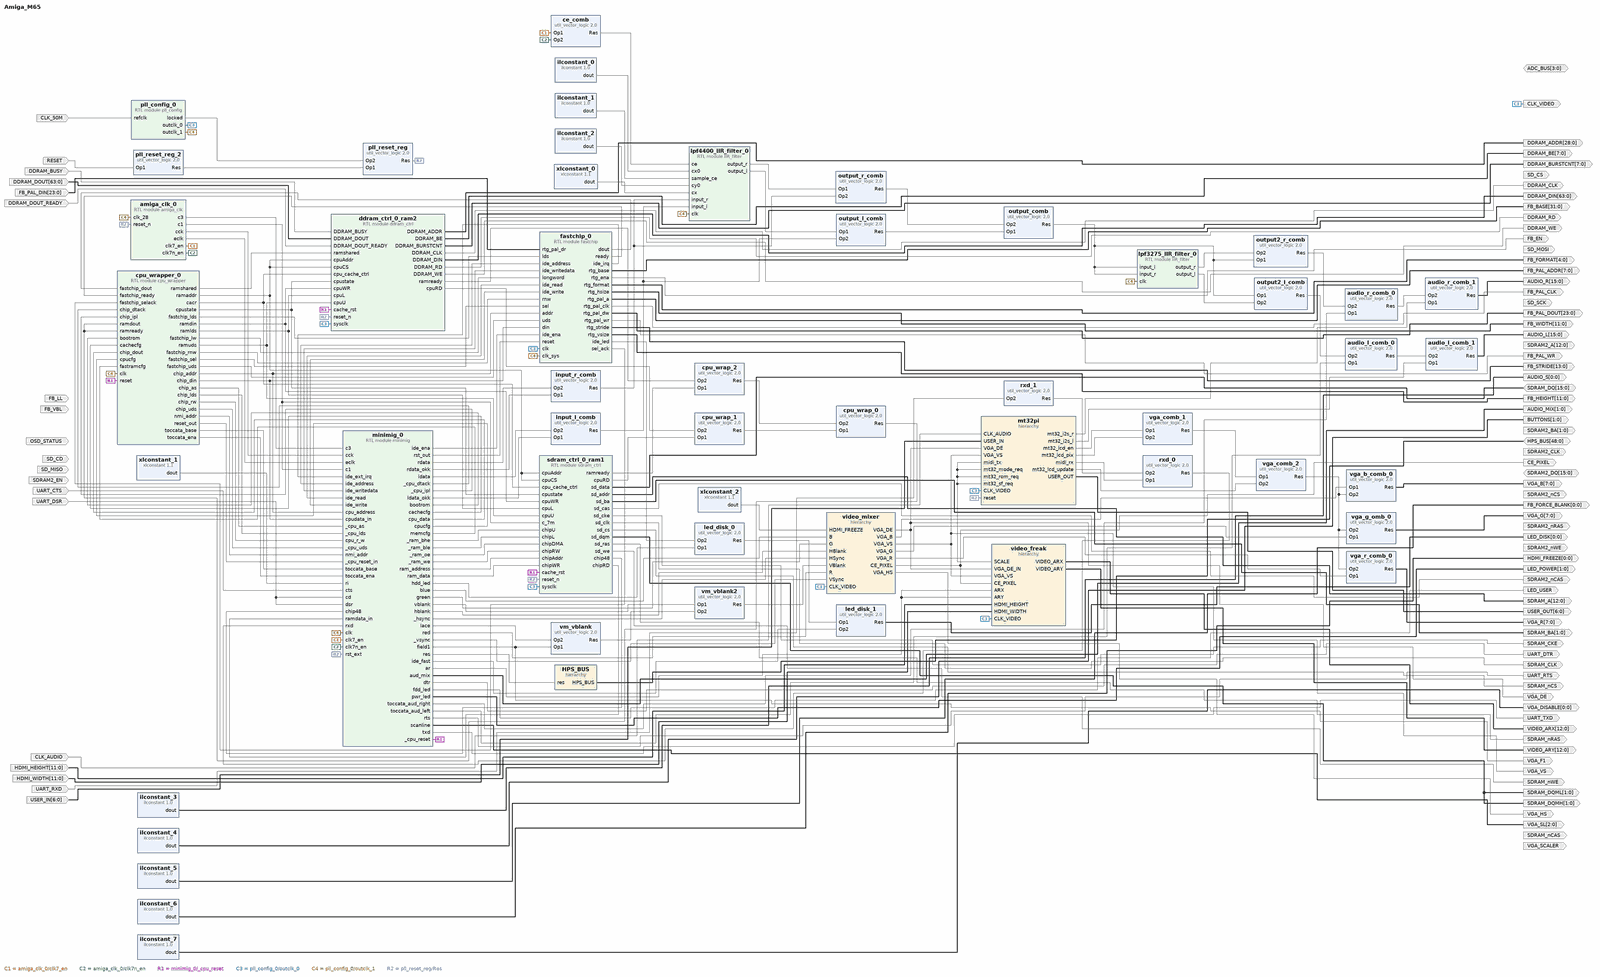
[diagram p0: block diagram of the top level, whole]
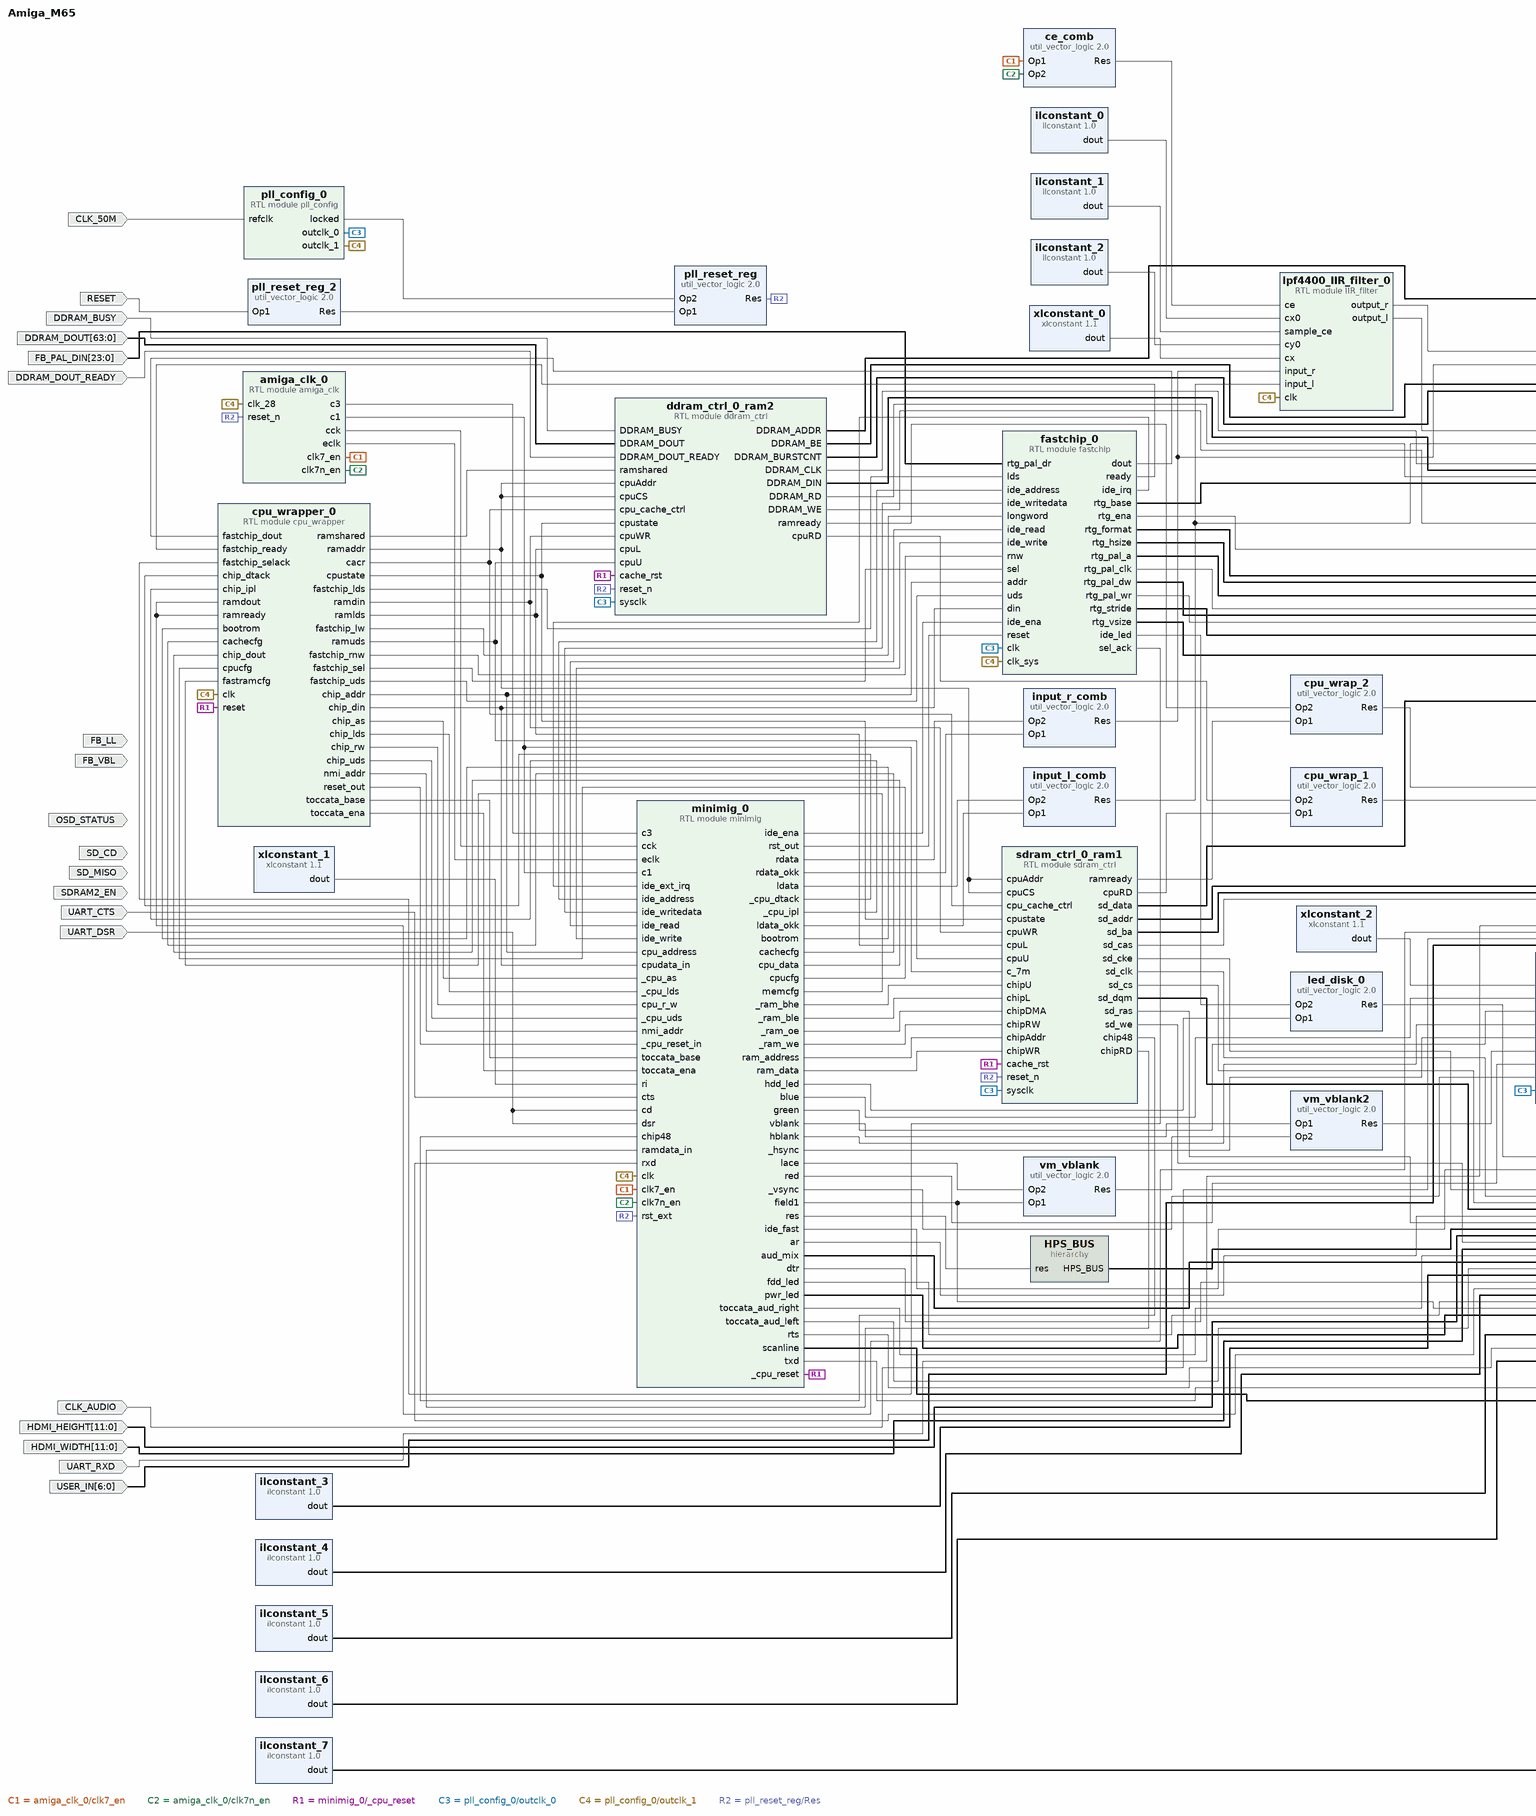
[diagram p1: block diagram of the top level, left part]
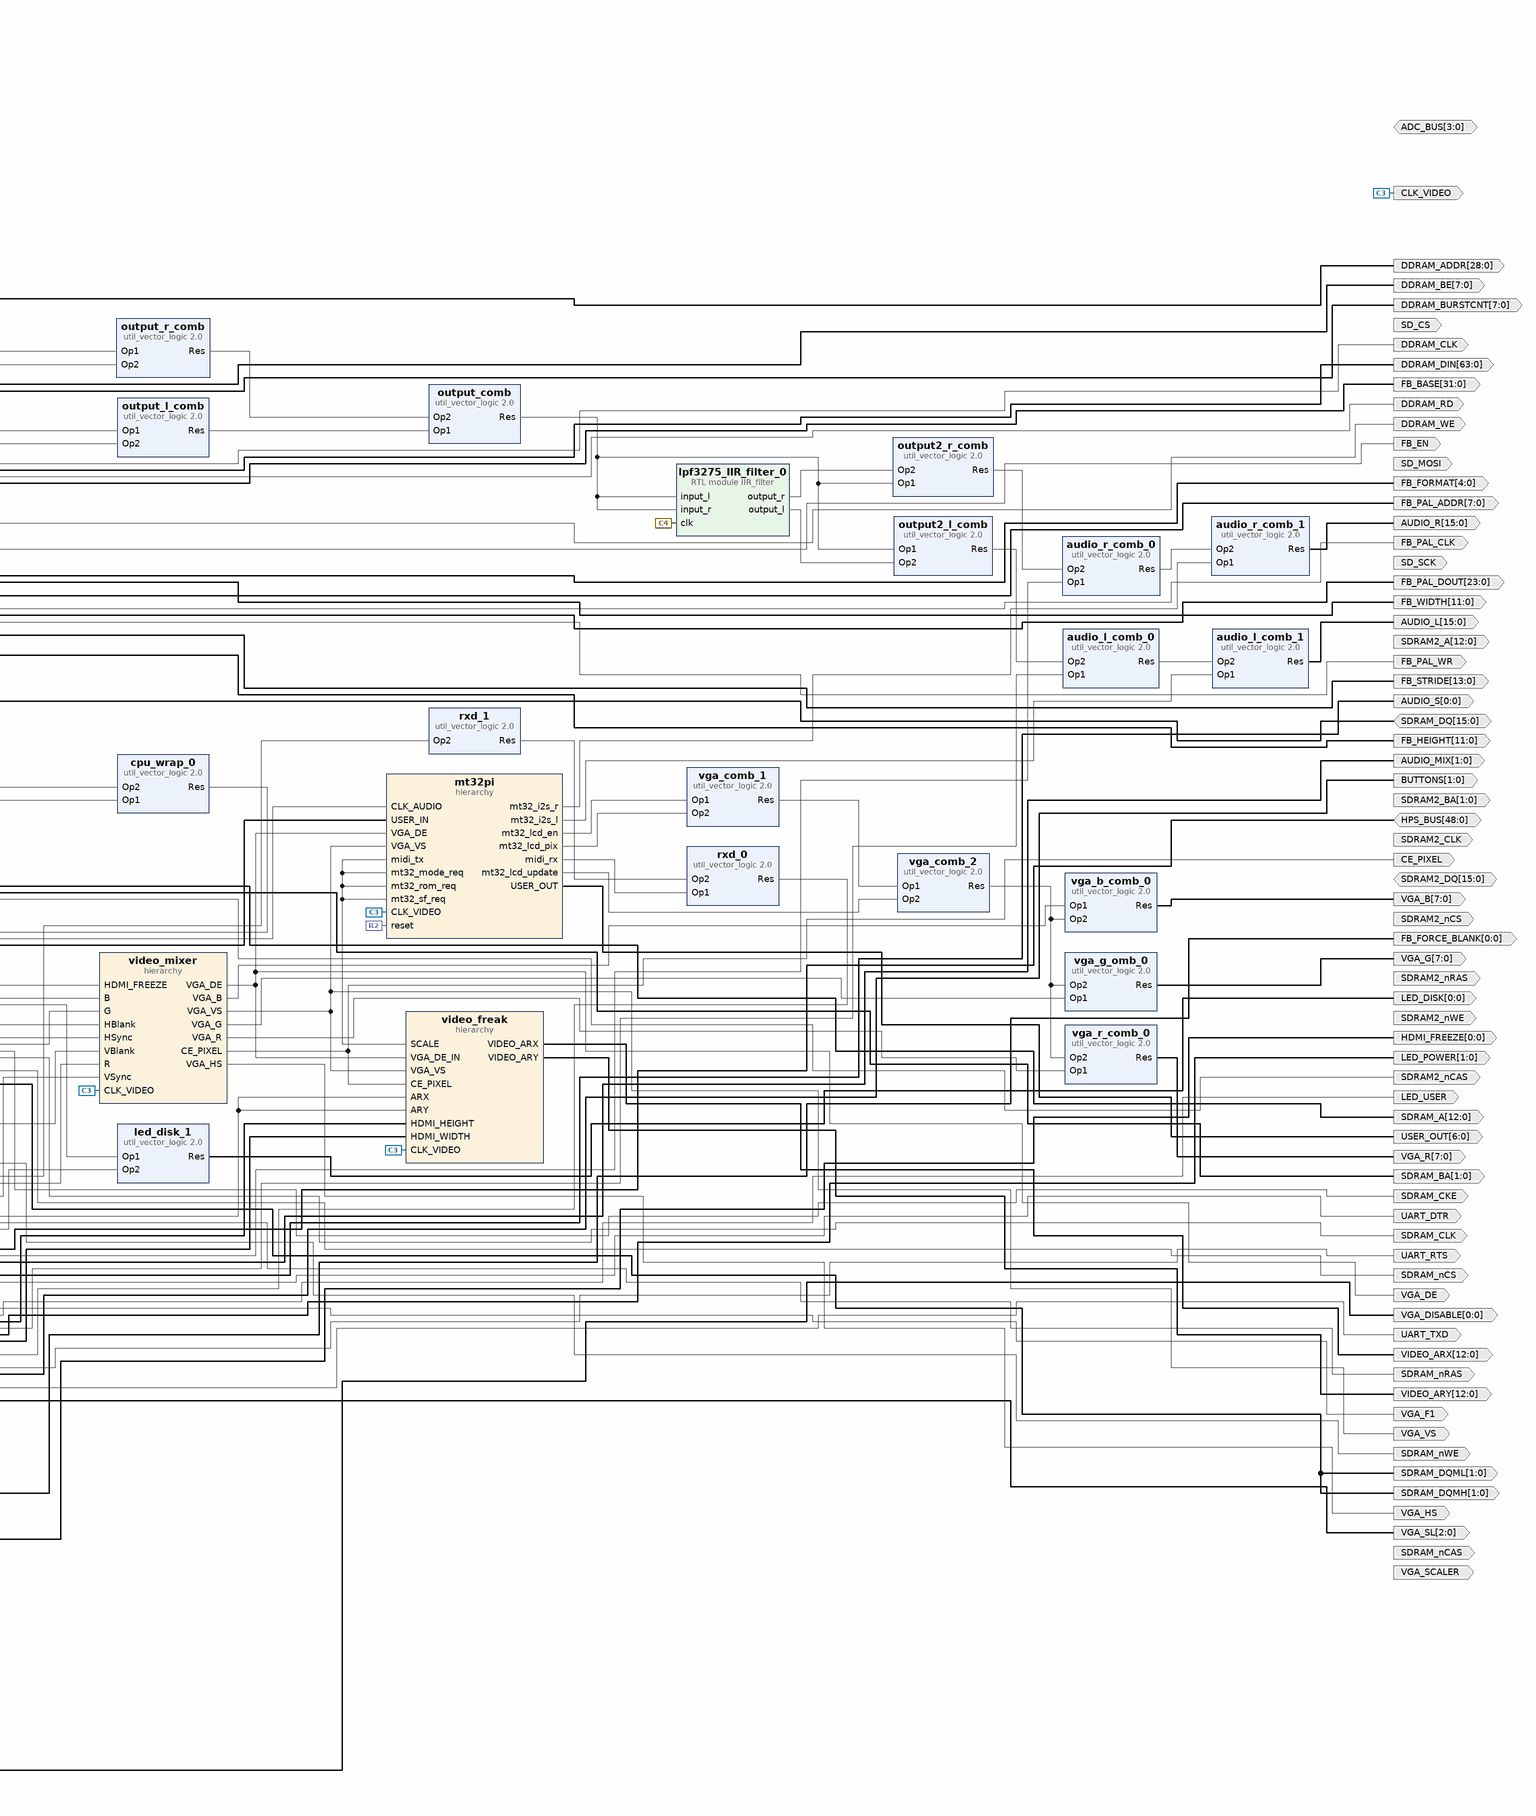
[diagram p2: block diagram of the top level, right part]
# Vivado block design Amiga_M65, xc7a200tfbg484-3, Vivado 2024.2.1
create_bd_design Amiga_M65

create_bd_port -dir I -type clk CLK_50M
set_property -dict {CONFIG.FREQ_HZ 50000000} [get_bd_ports CLK_50M]
create_bd_port -dir I -type rst RESET
set_property -dict {CONFIG.POLARITY ACTIVE_HIGH} [get_bd_ports RESET]
create_bd_port -dir IO -from 48 -to 0 HPS_BUS
create_bd_port -dir O -type clk CLK_VIDEO
create_bd_port -dir O CE_PIXEL
create_bd_port -dir O -from 12 -to 0 VIDEO_ARX
create_bd_port -dir O -from 12 -to 0 VIDEO_ARY
create_bd_port -dir O -from 7 -to 0 VGA_R
create_bd_port -dir O -from 7 -to 0 VGA_G
create_bd_port -dir O -from 7 -to 0 VGA_B
create_bd_port -dir O VGA_HS
create_bd_port -dir O VGA_VS
create_bd_port -dir O VGA_DE
create_bd_port -dir O VGA_F1
create_bd_port -dir O -from 2 -to 0 VGA_SL
create_bd_port -dir O VGA_SCALER
create_bd_port -dir O -from 0 -to 0 VGA_DISABLE
create_bd_port -dir I -from 11 -to 0 HDMI_WIDTH
create_bd_port -dir I -from 11 -to 0 HDMI_HEIGHT
create_bd_port -dir O -from 0 -to 0 HDMI_FREEZE
create_bd_port -dir O FB_EN
create_bd_port -dir O -from 4 -to 0 FB_FORMAT
create_bd_port -dir O -from 11 -to 0 FB_WIDTH
create_bd_port -dir O -from 11 -to 0 FB_HEIGHT
create_bd_port -dir O -from 31 -to 0 FB_BASE
create_bd_port -dir O -from 13 -to 0 FB_STRIDE
create_bd_port -dir I FB_VBL
create_bd_port -dir I FB_LL
create_bd_port -dir O -from 0 -to 0 FB_FORCE_BLANK
create_bd_port -dir O -type clk FB_PAL_CLK
create_bd_port -dir O -from 7 -to 0 FB_PAL_ADDR
create_bd_port -dir O -from 23 -to 0 FB_PAL_DOUT
create_bd_port -dir I -from 23 -to 0 FB_PAL_DIN
create_bd_port -dir O FB_PAL_WR
create_bd_port -dir O LED_USER
create_bd_port -dir O -from 1 -to 0 LED_POWER
create_bd_port -dir O -from 0 -to 0 LED_DISK
create_bd_port -dir O -from 1 -to 0 BUTTONS
create_bd_port -dir I -type clk CLK_AUDIO
set_property -dict {CONFIG.FREQ_HZ 24576000} [get_bd_ports CLK_AUDIO]
create_bd_port -dir O -from 15 -to 0 AUDIO_L
create_bd_port -dir O -from 15 -to 0 AUDIO_R
create_bd_port -dir O -from 0 -to 0 AUDIO_S
create_bd_port -dir O -from 1 -to 0 AUDIO_MIX
create_bd_port -dir IO -from 3 -to 0 ADC_BUS
create_bd_port -dir O SD_SCK
create_bd_port -dir O SD_MOSI
create_bd_port -dir I SD_MISO
create_bd_port -dir O SD_CS
create_bd_port -dir I SD_CD
create_bd_port -dir O -type clk DDRAM_CLK
create_bd_port -dir I DDRAM_BUSY
create_bd_port -dir O -from 7 -to 0 DDRAM_BURSTCNT
create_bd_port -dir O -from 28 -to 0 DDRAM_ADDR
create_bd_port -dir I -from 63 -to 0 DDRAM_DOUT
create_bd_port -dir I DDRAM_DOUT_READY
create_bd_port -dir O DDRAM_RD
create_bd_port -dir O -from 63 -to 0 DDRAM_DIN
create_bd_port -dir O -from 7 -to 0 DDRAM_BE
create_bd_port -dir O DDRAM_WE
create_bd_port -dir O -type clk SDRAM_CLK
create_bd_port -dir O SDRAM_CKE
create_bd_port -dir O -from 12 -to 0 SDRAM_A
create_bd_port -dir O -from 1 -to 0 SDRAM_BA
create_bd_port -dir IO -from 15 -to 0 SDRAM_DQ
create_bd_port -dir O -from 1 -to 0 SDRAM_DQML
create_bd_port -dir O -from 1 -to 0 SDRAM_DQMH
create_bd_port -dir O SDRAM_nCS
create_bd_port -dir O SDRAM_nCAS
create_bd_port -dir O SDRAM_nRAS
create_bd_port -dir O SDRAM_nWE
create_bd_port -dir I SDRAM2_EN
create_bd_port -dir O -type clk SDRAM2_CLK
create_bd_port -dir O -from 12 -to 0 SDRAM2_A
create_bd_port -dir O -from 1 -to 0 SDRAM2_BA
create_bd_port -dir IO -from 15 -to 0 SDRAM2_DQ
create_bd_port -dir O SDRAM2_nCS
create_bd_port -dir O SDRAM2_nCAS
create_bd_port -dir O SDRAM2_nRAS
create_bd_port -dir O SDRAM2_nWE
create_bd_port -dir I UART_CTS
create_bd_port -dir O UART_RTS
create_bd_port -dir I UART_RXD
create_bd_port -dir O UART_TXD
create_bd_port -dir O UART_DTR
create_bd_port -dir I UART_DSR
create_bd_port -dir I -from 6 -to 0 USER_IN
create_bd_port -dir O -from 6 -to 0 USER_OUT
create_bd_port -dir I OSD_STATUS

create_bd_cell -type module -reference amiga_clk amiga_clk_0
create_bd_cell -type ip -vlnv xilinx.com:ip:util_vector_logic:2.0 pll_reset_reg
set_property -dict {CONFIG.C_OPERATION or CONFIG.C_SIZE 1} [get_bd_cells pll_reset_reg]
create_bd_cell -type ip -vlnv xilinx.com:ip:util_vector_logic:2.0 pll_reset_reg_2
set_property -dict {CONFIG.C_OPERATION or CONFIG.C_SIZE 1} [get_bd_cells pll_reset_reg_2]
create_bd_cell -type module -reference cpu_wrapper cpu_wrapper_0
create_bd_cell -type module -reference minimig minimig_0
create_bd_cell -type module -reference fastchip fastchip_0
create_bd_cell -type module -reference sdram_ctrl sdram_ctrl_0_ram1
create_bd_cell -type module -reference IIR_filter lpf4400_IIR_filter_0
create_bd_cell -type module -reference IIR_filter lpf3275_IIR_filter_0
create_bd_cell -type module -reference ddram_ctrl ddram_ctrl_0_ram2
create_bd_cell -type hier mt32pi
create_bd_cell -type hier video_mixer
create_bd_cell -type hier video_freak
create_bd_cell -type ip -vlnv xilinx.com:ip:util_vector_logic:2.0 ce_comb
set_property -dict {CONFIG.C_OPERATION or CONFIG.C_SIZE 1} [get_bd_cells ce_comb]
create_bd_cell -type ip -vlnv xilinx.com:ip:xlconstant:1.1 xlconstant_0
set_property -dict {CONFIG.CONST_VAL 40 CONFIG.CONST_WIDTH 40} [get_bd_cells xlconstant_0]
create_bd_cell -type inline_hdl -vlnv xilinx.com:inline_hdl:ilconstant:1.0 ilconstant_0
set_property -dict {CONFIG.CONST_VAL 8 CONFIG.CONST_WIDTH 8} [get_bd_cells ilconstant_0]
create_bd_cell -type inline_hdl -vlnv xilinx.com:inline_hdl:ilconstant:1.0 ilconstant_1
create_bd_cell -type inline_hdl -vlnv xilinx.com:inline_hdl:ilconstant:1.0 ilconstant_2
set_property -dict {CONFIG.CONST_VAL 24 CONFIG.CONST_WIDTH 24} [get_bd_cells ilconstant_2]
create_bd_cell -type ip -vlnv xilinx.com:ip:util_vector_logic:2.0 input_l_comb
set_property -dict {CONFIG.C_SIZE 16} [get_bd_cells input_l_comb]
create_bd_cell -type ip -vlnv xilinx.com:ip:util_vector_logic:2.0 input_r_comb
set_property -dict {CONFIG.C_SIZE 16} [get_bd_cells input_r_comb]
create_bd_cell -type ip -vlnv xilinx.com:ip:util_vector_logic:2.0 output_l_comb
set_property -dict {CONFIG.C_SIZE 16} [get_bd_cells output_l_comb]
create_bd_cell -type ip -vlnv xilinx.com:ip:util_vector_logic:2.0 output_r_comb
set_property -dict {CONFIG.C_OPERATION and CONFIG.C_SIZE 16} [get_bd_cells output_r_comb]
create_bd_cell -type ip -vlnv xilinx.com:ip:util_vector_logic:2.0 output_comb
set_property -dict {CONFIG.C_SIZE 16} [get_bd_cells output_comb]
create_bd_cell -type ip -vlnv xilinx.com:ip:util_vector_logic:2.0 output2_l_comb
set_property -dict {CONFIG.C_SIZE 16} [get_bd_cells output2_l_comb]
create_bd_cell -type ip -vlnv xilinx.com:ip:util_vector_logic:2.0 output2_r_comb
set_property -dict {CONFIG.C_SIZE 16} [get_bd_cells output2_r_comb]
create_bd_cell -type ip -vlnv xilinx.com:ip:util_vector_logic:2.0 vm_vblank
set_property -dict {CONFIG.C_SIZE 1} [get_bd_cells vm_vblank]
create_bd_cell -type ip -vlnv xilinx.com:ip:util_vector_logic:2.0 vm_vblank2
set_property -dict {CONFIG.C_SIZE 1} [get_bd_cells vm_vblank2]
create_bd_cell -type hier HPS_BUS
create_bd_cell -type ip -vlnv xilinx.com:ip:util_vector_logic:2.0 led_disk_0
set_property -dict {CONFIG.C_SIZE 2} [get_bd_cells led_disk_0]
create_bd_cell -type ip -vlnv xilinx.com:ip:util_vector_logic:2.0 led_disk_1
set_property -dict {CONFIG.C_SIZE 1} [get_bd_cells led_disk_1]
create_bd_cell -type ip -vlnv xilinx.com:ip:util_vector_logic:2.0 audio_l_comb_0
set_property -dict {CONFIG.C_SIZE 16} [get_bd_cells audio_l_comb_0]
create_bd_cell -type ip -vlnv xilinx.com:ip:util_vector_logic:2.0 audio_r_comb_0
set_property -dict {CONFIG.C_SIZE 16} [get_bd_cells audio_r_comb_0]
create_bd_cell -type ip -vlnv xilinx.com:ip:xlconstant:1.1 xlconstant_1
create_bd_cell -type ip -vlnv xilinx.com:ip:util_vector_logic:2.0 cpu_wrap_0
set_property -dict {CONFIG.C_SIZE 16} [get_bd_cells cpu_wrap_0]
create_bd_cell -type ip -vlnv xilinx.com:ip:util_vector_logic:2.0 cpu_wrap_1
set_property -dict {CONFIG.C_SIZE 16} [get_bd_cells cpu_wrap_1]
create_bd_cell -type ip -vlnv xilinx.com:ip:util_vector_logic:2.0 cpu_wrap_2
set_property -dict {CONFIG.C_SIZE 1} [get_bd_cells cpu_wrap_2]
create_bd_cell -type ip -vlnv xilinx.com:ip:util_vector_logic:2.0 rxd_0
set_property -dict {CONFIG.C_SIZE 1} [get_bd_cells rxd_0]
create_bd_cell -type ip -vlnv xilinx.com:ip:util_vector_logic:2.0 rxd_1
set_property -dict {CONFIG.C_SIZE 1} [get_bd_cells rxd_1]
create_bd_cell -type ip -vlnv xilinx.com:ip:util_vector_logic:2.0 audio_r_comb_1
set_property -dict {CONFIG.C_SIZE 16} [get_bd_cells audio_r_comb_1]
create_bd_cell -type ip -vlnv xilinx.com:ip:util_vector_logic:2.0 audio_l_comb_1
set_property -dict {CONFIG.C_SIZE 16} [get_bd_cells audio_l_comb_1]
create_bd_cell -type ip -vlnv xilinx.com:ip:util_vector_logic:2.0 vga_b_comb_0
create_bd_cell -type ip -vlnv xilinx.com:ip:util_vector_logic:2.0 vga_g_omb_0
create_bd_cell -type ip -vlnv xilinx.com:ip:util_vector_logic:2.0 vga_r_comb_0
create_bd_cell -type ip -vlnv xilinx.com:ip:util_vector_logic:2.0 vga_comb_1
create_bd_cell -type ip -vlnv xilinx.com:ip:util_vector_logic:2.0 vga_comb_2
create_bd_cell -type ip -vlnv xilinx.com:ip:xlconstant:1.1 xlconstant_2
create_bd_cell -type inline_hdl -vlnv xilinx.com:inline_hdl:ilconstant:1.0 ilconstant_3
create_bd_cell -type inline_hdl -vlnv xilinx.com:inline_hdl:ilconstant:1.0 ilconstant_4
set_property -dict {CONFIG.CONST_VAL 2 CONFIG.CONST_WIDTH 2} [get_bd_cells ilconstant_4]
create_bd_cell -type inline_hdl -vlnv xilinx.com:inline_hdl:ilconstant:1.0 ilconstant_5
create_bd_cell -type inline_hdl -vlnv xilinx.com:inline_hdl:ilconstant:1.0 ilconstant_6
create_bd_cell -type inline_hdl -vlnv xilinx.com:inline_hdl:ilconstant:1.0 ilconstant_7
create_bd_cell -type module -reference pll_config pll_config_0

# ---- hierarchy /mt32pi ----
current_bd_instance /mt32pi
create_bd_pin -dir I CLK_AUDIO
create_bd_pin -dir I CLK_VIDEO
create_bd_pin -dir I CE_PIXEL
create_bd_pin -dir I VGA_VS
create_bd_pin -dir I VGA_DE
create_bd_pin -dir I -from 6 -to 0 USER_IN
create_bd_pin -dir O -from 6 -to 0 USER_OUT
create_bd_pin -dir I reset
create_bd_pin -dir I midi_tx
create_bd_pin -dir O midi_rx
create_bd_pin -dir O -from 15 -to 0 mt32_i2s_r
create_bd_pin -dir O -from 15 -to 0 mt32_i2s_l
create_bd_pin -dir O mt32_available
create_bd_pin -dir I mt32_mode_req
create_bd_pin -dir I -from 1 -to 0 mt32_rom_req
create_bd_pin -dir I -from 7 -to 0 mt32_sf_req
create_bd_pin -dir O -from 7 -to 0 mt32_mode
create_bd_pin -dir O -from 7 -to 0 mt32_rom
create_bd_pin -dir O -from 7 -to 0 mt32_sf
create_bd_pin -dir O mt32_newmode
create_bd_pin -dir O mt32_lcd_en
create_bd_pin -dir O mt32_lcd_pix
create_bd_pin -dir O mt32_lcd_update

# ---- hierarchy /video_mixer ----
current_bd_instance /video_mixer
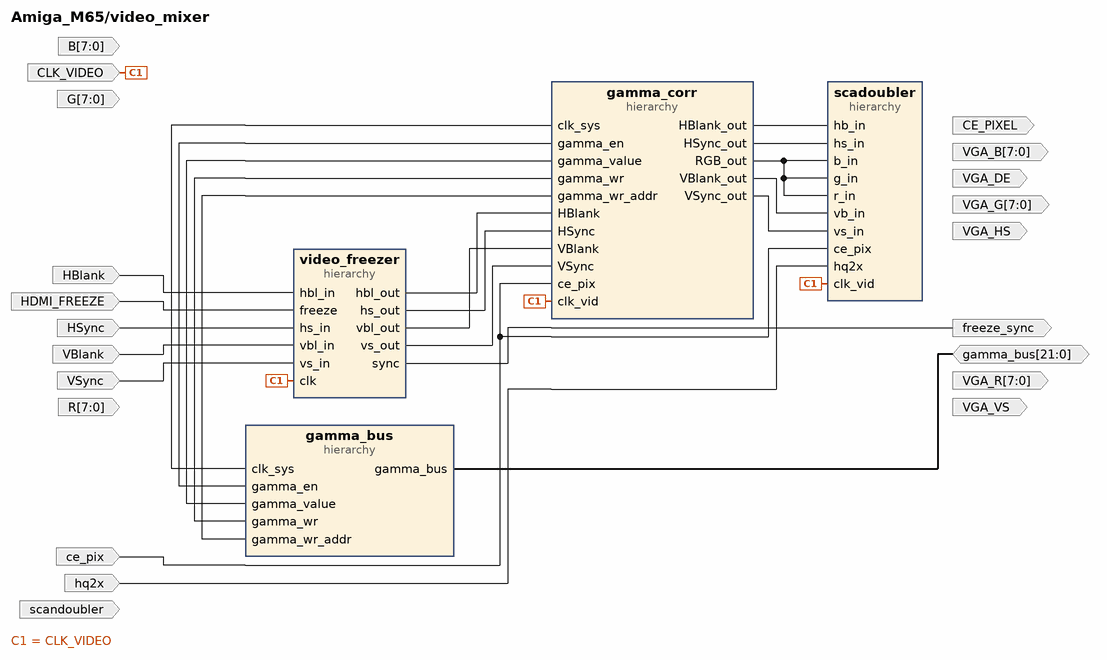
[diagram p3: block diagram inside /video_mixer]
create_bd_pin -dir I CLK_VIDEO
create_bd_pin -dir O CE_PIXEL
create_bd_pin -dir I ce_pix
create_bd_pin -dir I scandoubler
create_bd_pin -dir I hq2x
create_bd_pin -dir IO -from 21 -to 0 gamma_bus
create_bd_pin -dir I -from 7 -to 0 R
create_bd_pin -dir I -from 7 -to 0 G
create_bd_pin -dir I -from 7 -to 0 B
create_bd_pin -dir I HSync
create_bd_pin -dir I VSync
create_bd_pin -dir I HBlank
create_bd_pin -dir I VBlank
create_bd_pin -dir I HDMI_FREEZE
create_bd_pin -dir O freeze_sync
create_bd_pin -dir O -from 7 -to 0 VGA_R
create_bd_pin -dir O -from 7 -to 0 VGA_G
create_bd_pin -dir O -from 7 -to 0 VGA_B
create_bd_pin -dir O VGA_VS
create_bd_pin -dir O VGA_HS
create_bd_pin -dir O VGA_DE

create_bd_cell -type hier video_freezer
create_bd_cell -type hier scadoubler
create_bd_cell -type hier gamma_corr
create_bd_cell -type hier gamma_bus

# ---- hierarchy /video_mixer/video_freezer ----
current_bd_instance /video_mixer/video_freezer
create_bd_pin -dir I clk
create_bd_pin -dir O sync
create_bd_pin -dir I freeze
create_bd_pin -dir I hs_in
create_bd_pin -dir I vs_in
create_bd_pin -dir I hbl_in
create_bd_pin -dir I vbl_in
create_bd_pin -dir O hs_out
create_bd_pin -dir O vs_out
create_bd_pin -dir O hbl_out
create_bd_pin -dir O vbl_out

# ---- hierarchy /video_mixer/scadoubler ----
current_bd_instance /video_mixer/scadoubler
create_bd_pin -dir I clk_vid
create_bd_pin -dir I hq2x
create_bd_pin -dir I ce_pix
create_bd_pin -dir I hs_in
create_bd_pin -dir I vs_in
create_bd_pin -dir I hb_in
create_bd_pin -dir I vb_in
create_bd_pin -dir I -from 7 -to 0 r_in
create_bd_pin -dir I -from 7 -to 0 g_in
create_bd_pin -dir I -from 7 -to 0 b_in
create_bd_pin -dir O ce_pix_out
create_bd_pin -dir O hs_out
create_bd_pin -dir O vs_out
create_bd_pin -dir O hb_out
create_bd_pin -dir O vb_out
create_bd_pin -dir O -from 7 -to 0 r_out
create_bd_pin -dir O -from 7 -to 0 g_out
create_bd_pin -dir O -from 7 -to 0 b_out

# ---- hierarchy /video_mixer/gamma_corr ----
current_bd_instance /video_mixer/gamma_corr
create_bd_pin -dir I clk_sys
create_bd_pin -dir I clk_vid
create_bd_pin -dir I ce_pix
create_bd_pin -dir I gamma_en
create_bd_pin -dir I gamma_wr
create_bd_pin -dir I -from 9 -to 0 gamma_wr_addr
create_bd_pin -dir I -from 7 -to 0 gamma_value
create_bd_pin -dir I HSync
create_bd_pin -dir I VSync
create_bd_pin -dir I HBlank
create_bd_pin -dir I VBlank
create_bd_pin -dir I -from 23 -to 0 RGB_in
create_bd_pin -dir O HSync_out
create_bd_pin -dir O VSync_out
create_bd_pin -dir O HBlank_out
create_bd_pin -dir O VBlank_out
create_bd_pin -dir O -from 23 -to 0 RGB_out

# ---- hierarchy /video_mixer/gamma_bus ----
current_bd_instance /video_mixer/gamma_bus
create_bd_pin -dir IO -from 21 -to 0 gamma_bus
create_bd_pin -dir I clk_sys
create_bd_pin -dir I gamma_en
create_bd_pin -dir I gamma_wr
create_bd_pin -dir I gamma_wr_addr
create_bd_pin -dir I gamma_value

# ---- hierarchy /video_freak ----
current_bd_instance /video_freak
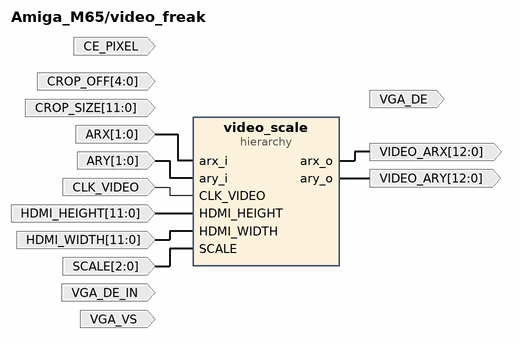
[diagram p4: block diagram inside /video_freak]
create_bd_pin -dir I CLK_VIDEO
create_bd_pin -dir I CE_PIXEL
create_bd_pin -dir I VGA_VS
create_bd_pin -dir I -from 11 -to 0 HDMI_WIDTH
create_bd_pin -dir I -from 11 -to 0 HDMI_HEIGHT
create_bd_pin -dir O VGA_DE
create_bd_pin -dir O -from 12 -to 0 VIDEO_ARX
create_bd_pin -dir O -from 12 -to 0 VIDEO_ARY
create_bd_pin -dir I VGA_DE_IN
create_bd_pin -dir I -from 1 -to 0 ARX
create_bd_pin -dir I -from 1 -to 0 ARY
create_bd_pin -dir I -from 11 -to 0 CROP_SIZE
create_bd_pin -dir I -from 4 -to 0 CROP_OFF
create_bd_pin -dir I -from 2 -to 0 SCALE

create_bd_cell -type hier video_scale

# ---- hierarchy /video_freak/video_scale ----
current_bd_instance /video_freak/video_scale
create_bd_pin -dir I CLK_VIDEO
create_bd_pin -dir I -from 11 -to 0 HDMI_WIDTH
create_bd_pin -dir I -from 11 -to 0 HDMI_HEIGHT
create_bd_pin -dir I -from 2 -to 0 SCALE
create_bd_pin -dir I -from 11 -to 0 hsize
create_bd_pin -dir I -from 11 -to 0 vsize
create_bd_pin -dir I -from 1 -to 0 arx_i
create_bd_pin -dir I -from 1 -to 0 ary_i
create_bd_pin -dir O -from 12 -to 0 arx_o
create_bd_pin -dir O -from 12 -to 0 ary_o

# ---- hierarchy /HPS_BUS ----
current_bd_instance /HPS_BUS
create_bd_pin -dir IO -from 48 -to 0 HPS_BUS
create_bd_pin -dir O -from 48 -to 0 HPS_BUS_o
create_bd_pin -dir I -from 48 -to 0 HPS_BUS_i
create_bd_pin -dir IO HPS_BUS_io
create_bd_pin -dir I -from 1 -to 0 res

# ---- connections ----

current_bd_instance /video_mixer
connect_bd_net [get_bd_pins CLK_VIDEO] [get_bd_pins video_freezer/clk] [get_bd_pins scadoubler/clk_vid] [get_bd_pins gamma_corr/clk_vid]
connect_bd_net [get_bd_pins HBlank] [get_bd_pins video_freezer/hbl_in]
connect_bd_net [get_bd_pins HDMI_FREEZE] [get_bd_pins video_freezer/freeze]
connect_bd_net [get_bd_pins HSync] [get_bd_pins video_freezer/hs_in]
connect_bd_net [get_bd_pins gamma_bus] [get_bd_pins gamma_bus/gamma_bus]
connect_bd_net [get_bd_pins VBlank] [get_bd_pins video_freezer/vbl_in]
connect_bd_net [get_bd_pins VSync] [get_bd_pins video_freezer/vs_in]
connect_bd_net -net X_clk_sys_1 [get_bd_pins gamma_corr/clk_sys] [get_bd_pins gamma_bus/clk_sys]
connect_bd_net [get_bd_pins ce_pix] [get_bd_pins scadoubler/ce_pix] [get_bd_pins gamma_corr/ce_pix]
connect_bd_net [get_bd_pins gamma_corr/HBlank_out] [get_bd_pins scadoubler/hb_in]
connect_bd_net [get_bd_pins gamma_corr/HSync_out] [get_bd_pins scadoubler/hs_in]
connect_bd_net [get_bd_pins gamma_corr/RGB_out] [get_bd_pins scadoubler/r_in] [get_bd_pins scadoubler/g_in] [get_bd_pins scadoubler/b_in]
connect_bd_net [get_bd_pins gamma_corr/VBlank_out] [get_bd_pins scadoubler/vb_in]
connect_bd_net [get_bd_pins gamma_corr/VSync_out] [get_bd_pins scadoubler/vs_in]
connect_bd_net -net gamma_en_1 [get_bd_pins gamma_corr/gamma_en] [get_bd_pins gamma_bus/gamma_en]
connect_bd_net -net gamma_value_1 [get_bd_pins gamma_corr/gamma_value] [get_bd_pins gamma_bus/gamma_value]
connect_bd_net -net gamma_wr_1 [get_bd_pins gamma_corr/gamma_wr] [get_bd_pins gamma_bus/gamma_wr]
connect_bd_net -net gamma_wr_addr_1 [get_bd_pins gamma_corr/gamma_wr_addr] [get_bd_pins gamma_bus/gamma_wr_addr]
connect_bd_net [get_bd_pins hq2x] [get_bd_pins scadoubler/hq2x]
connect_bd_net [get_bd_pins video_freezer/hbl_out] [get_bd_pins gamma_corr/HBlank]
connect_bd_net [get_bd_pins video_freezer/hs_out] [get_bd_pins gamma_corr/HSync]
connect_bd_net [get_bd_pins video_freezer/sync] [get_bd_pins freeze_sync]
connect_bd_net [get_bd_pins video_freezer/vbl_out] [get_bd_pins gamma_corr/VBlank]
connect_bd_net [get_bd_pins video_freezer/vs_out] [get_bd_pins gamma_corr/VSync]

current_bd_instance /video_freak
connect_bd_net [get_bd_pins ARX] [get_bd_pins video_scale/arx_i]
connect_bd_net [get_bd_pins ARY] [get_bd_pins video_scale/ary_i]
connect_bd_net [get_bd_pins CLK_VIDEO] [get_bd_pins video_scale/CLK_VIDEO]
connect_bd_net [get_bd_pins HDMI_HEIGHT] [get_bd_pins video_scale/HDMI_HEIGHT]
connect_bd_net [get_bd_pins HDMI_WIDTH] [get_bd_pins video_scale/HDMI_WIDTH]
connect_bd_net [get_bd_pins SCALE] [get_bd_pins video_scale/SCALE]
connect_bd_net [get_bd_pins video_scale/arx_o] [get_bd_pins VIDEO_ARX]
connect_bd_net [get_bd_pins video_scale/ary_o] [get_bd_pins VIDEO_ARY]

current_bd_instance /
connect_bd_net -net ARX_1 [get_bd_pins minimig_0/ar] [get_bd_pins video_freak/ARX] [get_bd_pins video_freak/ARY]
connect_bd_net -net B_1 [get_bd_pins minimig_0/blue] [get_bd_pins video_mixer/B]
connect_bd_net [get_bd_ports CLK_50M] [get_bd_pins pll_config_0/refclk]
connect_bd_net [get_bd_ports CLK_AUDIO] [get_bd_pins mt32pi/CLK_AUDIO]
connect_bd_net [get_bd_ports DDRAM_BUSY] [get_bd_pins ddram_ctrl_0_ram2/DDRAM_BUSY]
connect_bd_net [get_bd_ports DDRAM_DOUT] [get_bd_pins ddram_ctrl_0_ram2/DDRAM_DOUT]
connect_bd_net [get_bd_ports DDRAM_DOUT_READY] [get_bd_pins ddram_ctrl_0_ram2/DDRAM_DOUT_READY]
connect_bd_net [get_bd_ports FB_PAL_DIN] [get_bd_pins fastchip_0/rtg_pal_dr]
connect_bd_net -net G_1 [get_bd_pins minimig_0/green] [get_bd_pins video_mixer/G]
connect_bd_net -net HBlank_1 [get_bd_pins minimig_0/hblank] [get_bd_pins video_mixer/HBlank]
connect_bd_net [get_bd_ports HDMI_HEIGHT] [get_bd_pins video_freak/HDMI_HEIGHT]
connect_bd_net [get_bd_ports HDMI_WIDTH] [get_bd_pins video_freak/HDMI_WIDTH]
connect_bd_net -net HSync_1 [get_bd_pins minimig_0/_hsync] [get_bd_pins video_mixer/HSync]
connect_bd_net [get_bd_ports SDRAM_DQ] [get_bd_pins sdram_ctrl_0_ram1/sd_data]
connect_bd_net [get_bd_ports HPS_BUS] [get_bd_pins HPS_BUS/HPS_BUS]
connect_bd_net [get_bd_ports RESET] [get_bd_pins pll_reset_reg_2/Op1]
connect_bd_net -net R_1 [get_bd_pins minimig_0/red] [get_bd_pins video_mixer/R]
connect_bd_net [get_bd_ports UART_CTS] [get_bd_pins minimig_0/cts]
connect_bd_net [get_bd_ports UART_DSR] [get_bd_pins minimig_0/dsr] [get_bd_pins minimig_0/cd]
connect_bd_net [get_bd_ports UART_RXD] [get_bd_pins rxd_1/Op2]
connect_bd_net [get_bd_ports USER_IN] [get_bd_pins mt32pi/USER_IN]
connect_bd_net -net VSync_1 [get_bd_pins minimig_0/_vsync] [get_bd_pins video_mixer/VSync]
connect_bd_net [get_bd_pins amiga_clk_0/c1] [get_bd_pins minimig_0/c1] [get_bd_pins sdram_ctrl_0_ram1/c_7m]
connect_bd_net [get_bd_pins amiga_clk_0/c3] [get_bd_pins minimig_0/c3]
connect_bd_net [get_bd_pins amiga_clk_0/cck] [get_bd_pins minimig_0/cck]
connect_bd_net [get_bd_pins amiga_clk_0/clk7_en] [get_bd_pins minimig_0/clk7_en] [get_bd_pins ce_comb/Op1]
connect_bd_net [get_bd_pins amiga_clk_0/clk7n_en] [get_bd_pins minimig_0/clk7n_en] [get_bd_pins ce_comb/Op2]
connect_bd_net [get_bd_pins amiga_clk_0/eclk] [get_bd_pins minimig_0/eclk]
connect_bd_net [get_bd_pins audio_l_comb_0/Res] [get_bd_pins audio_l_comb_1/Op2]
connect_bd_net [get_bd_pins audio_l_comb_1/Res] [get_bd_ports AUDIO_L]
connect_bd_net [get_bd_pins audio_r_comb_0/Res] [get_bd_pins audio_r_comb_1/Op2]
connect_bd_net [get_bd_pins audio_r_comb_1/Res] [get_bd_ports AUDIO_R]
connect_bd_net [get_bd_pins ce_comb/Res] [get_bd_pins lpf4400_IIR_filter_0/ce]
connect_bd_net [get_bd_pins cpu_wrap_0/Res] [get_bd_pins cpu_wrapper_0/ramdout] [get_bd_pins cpu_wrapper_0/ramready]
connect_bd_net [get_bd_pins cpu_wrap_1/Res] [get_bd_pins cpu_wrap_0/Op1]
connect_bd_net [get_bd_pins cpu_wrap_2/Res] [get_bd_pins cpu_wrap_0/Op2]
connect_bd_net [get_bd_pins cpu_wrapper_0/cacr] [get_bd_pins sdram_ctrl_0_ram1/cpu_cache_ctrl] [get_bd_pins ddram_ctrl_0_ram2/cpu_cache_ctrl]
connect_bd_net [get_bd_pins cpu_wrapper_0/chip_addr] [get_bd_pins minimig_0/cpu_address] [get_bd_pins fastchip_0/addr]
connect_bd_net [get_bd_pins cpu_wrapper_0/chip_as] [get_bd_pins minimig_0/_cpu_as]
connect_bd_net [get_bd_pins cpu_wrapper_0/chip_din] [get_bd_pins minimig_0/cpudata_in] [get_bd_pins fastchip_0/din]
connect_bd_net [get_bd_pins cpu_wrapper_0/chip_lds] [get_bd_pins minimig_0/_cpu_lds]
connect_bd_net [get_bd_pins cpu_wrapper_0/chip_rw] [get_bd_pins minimig_0/cpu_r_w]
connect_bd_net [get_bd_pins cpu_wrapper_0/chip_uds] [get_bd_pins minimig_0/_cpu_uds]
connect_bd_net [get_bd_pins cpu_wrapper_0/cpustate] [get_bd_pins sdram_ctrl_0_ram1/cpustate] [get_bd_pins ddram_ctrl_0_ram2/cpustate]
connect_bd_net [get_bd_pins cpu_wrapper_0/fastchip_lds] [get_bd_pins fastchip_0/lds]
connect_bd_net [get_bd_pins cpu_wrapper_0/fastchip_lw] [get_bd_pins fastchip_0/longword]
connect_bd_net [get_bd_pins cpu_wrapper_0/fastchip_rnw] [get_bd_pins fastchip_0/rnw]
connect_bd_net [get_bd_pins cpu_wrapper_0/fastchip_sel] [get_bd_pins fastchip_0/sel]
connect_bd_net [get_bd_pins cpu_wrapper_0/fastchip_uds] [get_bd_pins fastchip_0/uds]
connect_bd_net [get_bd_pins cpu_wrapper_0/nmi_addr] [get_bd_pins minimig_0/nmi_addr]
connect_bd_net [get_bd_pins cpu_wrapper_0/ramaddr] \
  [get_bd_pins sdram_ctrl_0_ram1/cpuAddr] [get_bd_pins sdram_ctrl_0_ram1/cpuCS] [get_bd_pins ddram_ctrl_0_ram2/cpuCS] \
  [get_bd_pins ddram_ctrl_0_ram2/cpuAddr]
connect_bd_net [get_bd_pins cpu_wrapper_0/ramdin] [get_bd_pins sdram_ctrl_0_ram1/cpuWR] [get_bd_pins ddram_ctrl_0_ram2/cpuWR]
connect_bd_net [get_bd_pins cpu_wrapper_0/ramlds] [get_bd_pins sdram_ctrl_0_ram1/cpuL] [get_bd_pins ddram_ctrl_0_ram2/cpuL]
connect_bd_net [get_bd_pins cpu_wrapper_0/ramshared] [get_bd_pins ddram_ctrl_0_ram2/ramshared]
connect_bd_net [get_bd_pins cpu_wrapper_0/ramuds] [get_bd_pins sdram_ctrl_0_ram1/cpuU] [get_bd_pins ddram_ctrl_0_ram2/cpuU]
connect_bd_net [get_bd_pins cpu_wrapper_0/reset_out] [get_bd_pins minimig_0/_cpu_reset_in]
connect_bd_net [get_bd_pins cpu_wrapper_0/toccata_base] [get_bd_pins minimig_0/toccata_base]
connect_bd_net [get_bd_pins cpu_wrapper_0/toccata_ena] [get_bd_pins minimig_0/toccata_ena]
connect_bd_net [get_bd_pins ddram_ctrl_0_ram2/DDRAM_ADDR] [get_bd_ports DDRAM_ADDR]
connect_bd_net [get_bd_pins ddram_ctrl_0_ram2/DDRAM_BE] [get_bd_ports DDRAM_BE]
connect_bd_net [get_bd_pins ddram_ctrl_0_ram2/DDRAM_BURSTCNT] [get_bd_ports DDRAM_BURSTCNT]
connect_bd_net [get_bd_pins ddram_ctrl_0_ram2/DDRAM_CLK] [get_bd_ports DDRAM_CLK]
connect_bd_net [get_bd_pins ddram_ctrl_0_ram2/DDRAM_DIN] [get_bd_ports DDRAM_DIN]
connect_bd_net [get_bd_pins ddram_ctrl_0_ram2/DDRAM_RD] [get_bd_ports DDRAM_RD]
connect_bd_net [get_bd_pins ddram_ctrl_0_ram2/DDRAM_WE] [get_bd_ports DDRAM_WE]
connect_bd_net [get_bd_pins ddram_ctrl_0_ram2/cpuRD] [get_bd_pins cpu_wrap_1/Op2]
connect_bd_net [get_bd_pins ddram_ctrl_0_ram2/ramready] [get_bd_pins cpu_wrap_2/Op2]
connect_bd_net [get_bd_pins fastchip_0/dout] [get_bd_pins cpu_wrapper_0/fastchip_dout]
connect_bd_net [get_bd_pins fastchip_0/ide_irq] [get_bd_pins minimig_0/ide_ext_irq]
connect_bd_net [get_bd_pins fastchip_0/ide_led] [get_bd_pins led_disk_0/Op2]
connect_bd_net [get_bd_pins fastchip_0/ready] [get_bd_pins cpu_wrapper_0/fastchip_ready]
connect_bd_net [get_bd_pins fastchip_0/rtg_base] [get_bd_ports FB_BASE]
connect_bd_net [get_bd_pins fastchip_0/rtg_ena] [get_bd_ports FB_EN]
connect_bd_net [get_bd_pins fastchip_0/rtg_format] [get_bd_ports FB_FORMAT]
connect_bd_net [get_bd_pins fastchip_0/rtg_hsize] [get_bd_ports FB_WIDTH]
connect_bd_net [get_bd_pins fastchip_0/rtg_pal_a] [get_bd_ports FB_PAL_ADDR]
connect_bd_net [get_bd_pins fastchip_0/rtg_pal_clk] [get_bd_ports FB_PAL_CLK]
connect_bd_net [get_bd_pins fastchip_0/rtg_pal_dw] [get_bd_ports FB_PAL_DOUT]
connect_bd_net [get_bd_pins fastchip_0/rtg_pal_wr] [get_bd_ports FB_PAL_WR]
connect_bd_net [get_bd_pins fastchip_0/rtg_stride] [get_bd_ports FB_STRIDE]
connect_bd_net [get_bd_pins fastchip_0/rtg_vsize] [get_bd_ports FB_HEIGHT]
connect_bd_net [get_bd_pins fastchip_0/sel_ack] [get_bd_pins cpu_wrapper_0/fastchip_selack]
connect_bd_net -net hps_ext_0_ide_addr [get_bd_pins minimig_0/ide_address] [get_bd_pins fastchip_0/ide_address]
connect_bd_net -net hps_ext_0_ide_dout [get_bd_pins minimig_0/ide_writedata] [get_bd_pins fastchip_0/ide_writedata]
connect_bd_net -net hps_ext_0_ide_rd [get_bd_pins minimig_0/ide_read] [get_bd_pins fastchip_0/ide_read]
connect_bd_net -net hps_ext_0_ide_wr [get_bd_pins minimig_0/ide_write] [get_bd_pins fastchip_0/ide_write]
connect_bd_net -net hps_io_hier_status [get_bd_pins mt32pi/midi_tx] \
  [get_bd_pins mt32pi/mt32_mode_req] [get_bd_pins mt32pi/mt32_rom_req] [get_bd_pins mt32pi/mt32_sf_req] \
  [get_bd_pins video_freak/SCALE]
connect_bd_net [get_bd_pins ilconstant_0/dout] [get_bd_pins lpf4400_IIR_filter_0/cx0]
connect_bd_net [get_bd_pins ilconstant_1/dout] [get_bd_pins lpf4400_IIR_filter_0/sample_ce]
connect_bd_net [get_bd_pins ilconstant_2/dout] [get_bd_pins lpf4400_IIR_filter_0/cy0]
connect_bd_net [get_bd_pins ilconstant_3/dout] [get_bd_ports AUDIO_S]
connect_bd_net [get_bd_pins ilconstant_4/dout] [get_bd_ports BUTTONS]
connect_bd_net [get_bd_pins ilconstant_5/dout] [get_bd_ports FB_FORCE_BLANK]
connect_bd_net [get_bd_pins ilconstant_6/dout] [get_bd_ports HDMI_FREEZE]
connect_bd_net [get_bd_pins ilconstant_7/dout] [get_bd_ports VGA_DISABLE]
connect_bd_net [get_bd_pins input_l_comb/Res] [get_bd_pins lpf4400_IIR_filter_0/input_l] [get_bd_pins output_l_comb/Op2]
connect_bd_net [get_bd_pins input_r_comb/Res] [get_bd_pins lpf4400_IIR_filter_0/input_r] [get_bd_pins output_r_comb/Op2]
connect_bd_net [get_bd_pins led_disk_0/Res] [get_bd_pins led_disk_1/Op1]
connect_bd_net [get_bd_pins led_disk_1/Res] [get_bd_ports LED_DISK]
connect_bd_net [get_bd_pins lpf3275_IIR_filter_0/output_l] [get_bd_pins output2_l_comb/Op2]
connect_bd_net [get_bd_pins lpf3275_IIR_filter_0/output_r] [get_bd_pins output2_r_comb/Op2]
connect_bd_net [get_bd_pins lpf4400_IIR_filter_0/output_l] [get_bd_pins output_l_comb/Op1]
connect_bd_net [get_bd_pins lpf4400_IIR_filter_0/output_r] [get_bd_pins output_r_comb/Op1]
connect_bd_net [get_bd_pins minimig_0/_cpu_dtack] [get_bd_pins cpu_wrapper_0/chip_dtack]
connect_bd_net [get_bd_pins minimig_0/_cpu_ipl] [get_bd_pins cpu_wrapper_0/chip_ipl]
connect_bd_net [get_bd_pins minimig_0/_cpu_reset] \
  [get_bd_pins cpu_wrapper_0/reset] [get_bd_pins ddram_ctrl_0_ram2/cache_rst] [get_bd_pins sdram_ctrl_0_ram1/cache_rst]
connect_bd_net [get_bd_pins minimig_0/_ram_bhe] [get_bd_pins sdram_ctrl_0_ram1/chipU]
connect_bd_net [get_bd_pins minimig_0/_ram_ble] [get_bd_pins sdram_ctrl_0_ram1/chipL]
connect_bd_net [get_bd_pins minimig_0/_ram_oe] [get_bd_pins sdram_ctrl_0_ram1/chipDMA]
connect_bd_net [get_bd_pins minimig_0/_ram_we] [get_bd_pins sdram_ctrl_0_ram1/chipRW]
connect_bd_net [get_bd_pins minimig_0/aud_mix] [get_bd_ports AUDIO_MIX]
connect_bd_net [get_bd_pins minimig_0/bootrom] [get_bd_pins cpu_wrapper_0/bootrom]
connect_bd_net [get_bd_pins minimig_0/cachecfg] [get_bd_pins cpu_wrapper_0/cachecfg]
connect_bd_net [get_bd_pins minimig_0/cpu_data] [get_bd_pins cpu_wrapper_0/chip_dout]
connect_bd_net [get_bd_pins minimig_0/cpucfg] [get_bd_pins cpu_wrapper_0/cpucfg]
connect_bd_net [get_bd_pins minimig_0/dtr] [get_bd_ports UART_DTR]
connect_bd_net [get_bd_pins minimig_0/fdd_led] [get_bd_ports LED_USER]
connect_bd_net [get_bd_pins minimig_0/field1] [get_bd_ports VGA_F1] [get_bd_pins vm_vblank/Op1]
connect_bd_net [get_bd_pins minimig_0/hdd_led] [get_bd_pins led_disk_0/Op1]
connect_bd_net [get_bd_pins minimig_0/ide_ena] [get_bd_pins fastchip_0/ide_ena]
connect_bd_net [get_bd_pins minimig_0/ide_fast] [get_bd_pins led_disk_1/Op2]
connect_bd_net [get_bd_pins minimig_0/lace] [get_bd_pins vm_vblank/Op2]
connect_bd_net [get_bd_pins minimig_0/ldata] [get_bd_pins input_l_comb/Op2]
connect_bd_net [get_bd_pins minimig_0/ldata_okk] [get_bd_pins input_l_comb/Op1]
connect_bd_net [get_bd_pins minimig_0/memcfg] [get_bd_pins cpu_wrapper_0/fastramcfg]
connect_bd_net [get_bd_pins minimig_0/pwr_led] [get_bd_ports LED_POWER]
connect_bd_net [get_bd_pins minimig_0/ram_address] [get_bd_pins sdram_ctrl_0_ram1/chipAddr]
connect_bd_net [get_bd_pins minimig_0/ram_data] [get_bd_pins sdram_ctrl_0_ram1/chipWR]
connect_bd_net [get_bd_pins minimig_0/rdata] [get_bd_pins input_r_comb/Op2]
connect_bd_net [get_bd_pins minimig_0/rdata_okk] [get_bd_pins input_r_comb/Op1]
connect_bd_net [get_bd_pins minimig_0/res] [get_bd_pins HPS_BUS/res]
connect_bd_net [get_bd_pins minimig_0/rst_out] [get_bd_pins fastchip_0/reset]
connect_bd_net [get_bd_pins minimig_0/rts] [get_bd_ports UART_RTS]
connect_bd_net [get_bd_pins minimig_0/scanline] [get_bd_ports VGA_SL]
connect_bd_net [get_bd_pins minimig_0/toccata_aud_left] [get_bd_pins audio_l_comb_0/Op1]
connect_bd_net [get_bd_pins minimig_0/toccata_aud_right] [get_bd_pins audio_r_comb_0/Op1]
connect_bd_net [get_bd_pins minimig_0/txd] [get_bd_ports UART_TXD]
connect_bd_net [get_bd_pins minimig_0/vblank] [get_bd_pins vm_vblank2/Op1]
connect_bd_net [get_bd_pins mt32pi/USER_OUT] [get_bd_ports USER_OUT]
connect_bd_net [get_bd_pins mt32pi/midi_rx] [get_bd_pins rxd_0/Op1]
connect_bd_net [get_bd_pins mt32pi/mt32_i2s_l] [get_bd_pins audio_l_comb_1/Op1]
connect_bd_net [get_bd_pins mt32pi/mt32_i2s_r] [get_bd_pins audio_r_comb_1/Op1]
connect_bd_net [get_bd_pins mt32pi/mt32_lcd_en] [get_bd_pins vga_comb_1/Op1]
connect_bd_net [get_bd_pins mt32pi/mt32_lcd_pix] [get_bd_pins vga_comb_1/Op2]
connect_bd_net [get_bd_pins mt32pi/mt32_lcd_update] [get_bd_pins vga_comb_2/Op2]
connect_bd_net [get_bd_pins output2_l_comb/Res] [get_bd_pins audio_l_comb_0/Op2]
connect_bd_net [get_bd_pins output2_r_comb/Res] [get_bd_pins audio_r_comb_0/Op2]
connect_bd_net [get_bd_pins output_comb/Res] \
  [get_bd_pins lpf3275_IIR_filter_0/input_l] [get_bd_pins lpf3275_IIR_filter_0/input_r] [get_bd_pins output2_l_comb/Op1] \
  [get_bd_pins output2_r_comb/Op1]
connect_bd_net [get_bd_pins output_l_comb/Res] [get_bd_pins output_comb/Op1]
connect_bd_net [get_bd_pins output_r_comb/Res] [get_bd_pins output_comb/Op2]
connect_bd_net [get_bd_pins pll_config_0/locked] [get_bd_pins pll_reset_reg/Op2]
connect_bd_net [get_bd_pins pll_config_0/outclk_0] \
  [get_bd_pins video_mixer/CLK_VIDEO] [get_bd_pins video_freak/CLK_VIDEO] [get_bd_ports CLK_VIDEO] \
  [get_bd_pins fastchip_0/clk] [get_bd_pins sdram_ctrl_0_ram1/sysclk] [get_bd_pins ddram_ctrl_0_ram2/sysclk] \
  [get_bd_pins mt32pi/CLK_VIDEO]
connect_bd_net [get_bd_pins pll_config_0/outclk_1] \
  [get_bd_pins amiga_clk_0/clk_28] [get_bd_pins lpf4400_IIR_filter_0/clk] [get_bd_pins lpf3275_IIR_filter_0/clk] \
  [get_bd_pins fastchip_0/clk_sys] [get_bd_pins minimig_0/clk] [get_bd_pins cpu_wrapper_0/clk]
connect_bd_net [get_bd_pins pll_reset_reg_2/Res] [get_bd_pins pll_reset_reg/Op1]
connect_bd_net [get_bd_pins pll_reset_reg/Res] \
  [get_bd_pins amiga_clk_0/reset_n] [get_bd_pins sdram_ctrl_0_ram1/reset_n] [get_bd_pins minimig_0/rst_ext] \
  [get_bd_pins mt32pi/reset] [get_bd_pins ddram_ctrl_0_ram2/reset_n]
connect_bd_net [get_bd_pins rxd_0/Res] [get_bd_pins minimig_0/rxd]
connect_bd_net [get_bd_pins rxd_1/Res] [get_bd_pins rxd_0/Op2]
connect_bd_net [get_bd_pins sdram_ctrl_0_ram1/chip48] [get_bd_pins minimig_0/chip48]
connect_bd_net [get_bd_pins sdram_ctrl_0_ram1/chipRD] [get_bd_pins minimig_0/ramdata_in]
connect_bd_net [get_bd_pins sdram_ctrl_0_ram1/cpuRD] [get_bd_pins cpu_wrap_1/Op1]
connect_bd_net [get_bd_pins sdram_ctrl_0_ram1/ramready] [get_bd_pins cpu_wrap_2/Op1]
connect_bd_net [get_bd_pins sdram_ctrl_0_ram1/sd_addr] [get_bd_ports SDRAM_A]
connect_bd_net [get_bd_pins sdram_ctrl_0_ram1/sd_ba] [get_bd_ports SDRAM_BA]
connect_bd_net [get_bd_pins sdram_ctrl_0_ram1/sd_cas] [get_bd_ports SDRAM2_nCAS]
connect_bd_net [get_bd_pins sdram_ctrl_0_ram1/sd_cke] [get_bd_ports SDRAM_CKE]
connect_bd_net [get_bd_pins sdram_ctrl_0_ram1/sd_clk] [get_bd_ports SDRAM_CLK]
connect_bd_net [get_bd_pins sdram_ctrl_0_ram1/sd_cs] [get_bd_ports SDRAM_nCS]
connect_bd_net [get_bd_pins sdram_ctrl_0_ram1/sd_dqm] [get_bd_ports SDRAM_DQMH] [get_bd_ports SDRAM_DQML]
connect_bd_net [get_bd_pins sdram_ctrl_0_ram1/sd_ras] [get_bd_ports SDRAM_nRAS]
connect_bd_net [get_bd_pins sdram_ctrl_0_ram1/sd_we] [get_bd_ports SDRAM_nWE]
connect_bd_net [get_bd_pins vga_b_comb_0/Res] [get_bd_ports VGA_B]
connect_bd_net [get_bd_pins vga_comb_1/Res] [get_bd_pins vga_comb_2/Op1]
connect_bd_net [get_bd_pins vga_comb_2/Res] [get_bd_pins vga_b_comb_0/Op2] [get_bd_pins vga_g_omb_0/Op2] [get_bd_pins vga_r_comb_0/Op2]
connect_bd_net [get_bd_pins vga_g_omb_0/Res] [get_bd_ports VGA_G]
connect_bd_net [get_bd_pins vga_r_comb_0/Res] [get_bd_ports VGA_R]
connect_bd_net [get_bd_pins video_freak/VIDEO_ARX] [get_bd_ports VIDEO_ARX]
connect_bd_net [get_bd_pins video_freak/VIDEO_ARY] [get_bd_ports VIDEO_ARY]
connect_bd_net [get_bd_pins video_mixer/CE_PIXEL] [get_bd_pins video_freak/CE_PIXEL] [get_bd_ports CE_PIXEL]
connect_bd_net [get_bd_pins video_mixer/VGA_B] [get_bd_pins vga_b_comb_0/Op1]
connect_bd_net [get_bd_pins video_mixer/VGA_DE] [get_bd_pins video_freak/VGA_DE_IN] [get_bd_ports VGA_DE] [get_bd_pins mt32pi/VGA_DE]
connect_bd_net [get_bd_pins video_mixer/VGA_G] [get_bd_pins vga_g_omb_0/Op1]
connect_bd_net [get_bd_pins video_mixer/VGA_HS] [get_bd_ports VGA_HS]
connect_bd_net [get_bd_pins video_mixer/VGA_R] [get_bd_pins vga_r_comb_0/Op1]
connect_bd_net [get_bd_pins video_mixer/VGA_VS] [get_bd_pins video_freak/VGA_VS] [get_bd_ports VGA_VS] [get_bd_pins mt32pi/VGA_VS]
connect_bd_net [get_bd_pins vm_vblank2/Res] [get_bd_pins video_mixer/VBlank]
connect_bd_net [get_bd_pins vm_vblank/Res] [get_bd_pins vm_vblank2/Op2]
connect_bd_net [get_bd_pins xlconstant_0/dout] [get_bd_pins lpf4400_IIR_filter_0/cx]
connect_bd_net [get_bd_pins xlconstant_1/dout] [get_bd_pins minimig_0/ri]
connect_bd_net [get_bd_pins xlconstant_2/dout] [get_bd_pins video_mixer/HDMI_FREEZE]

set_property USER_COMMENTS.comment_0 {To Be Completed} [current_bd_design]

validate_bd_design
save_bd_design
